# EasyEDA schematic SCH_sonnn_2025-09-09.json
TITLE: Sheet_1; REV: 2.0; Date: 2023-12-30; Sheet: 1/1; Drawn By: Belinay ve M. Ramazan; Company: Your Company
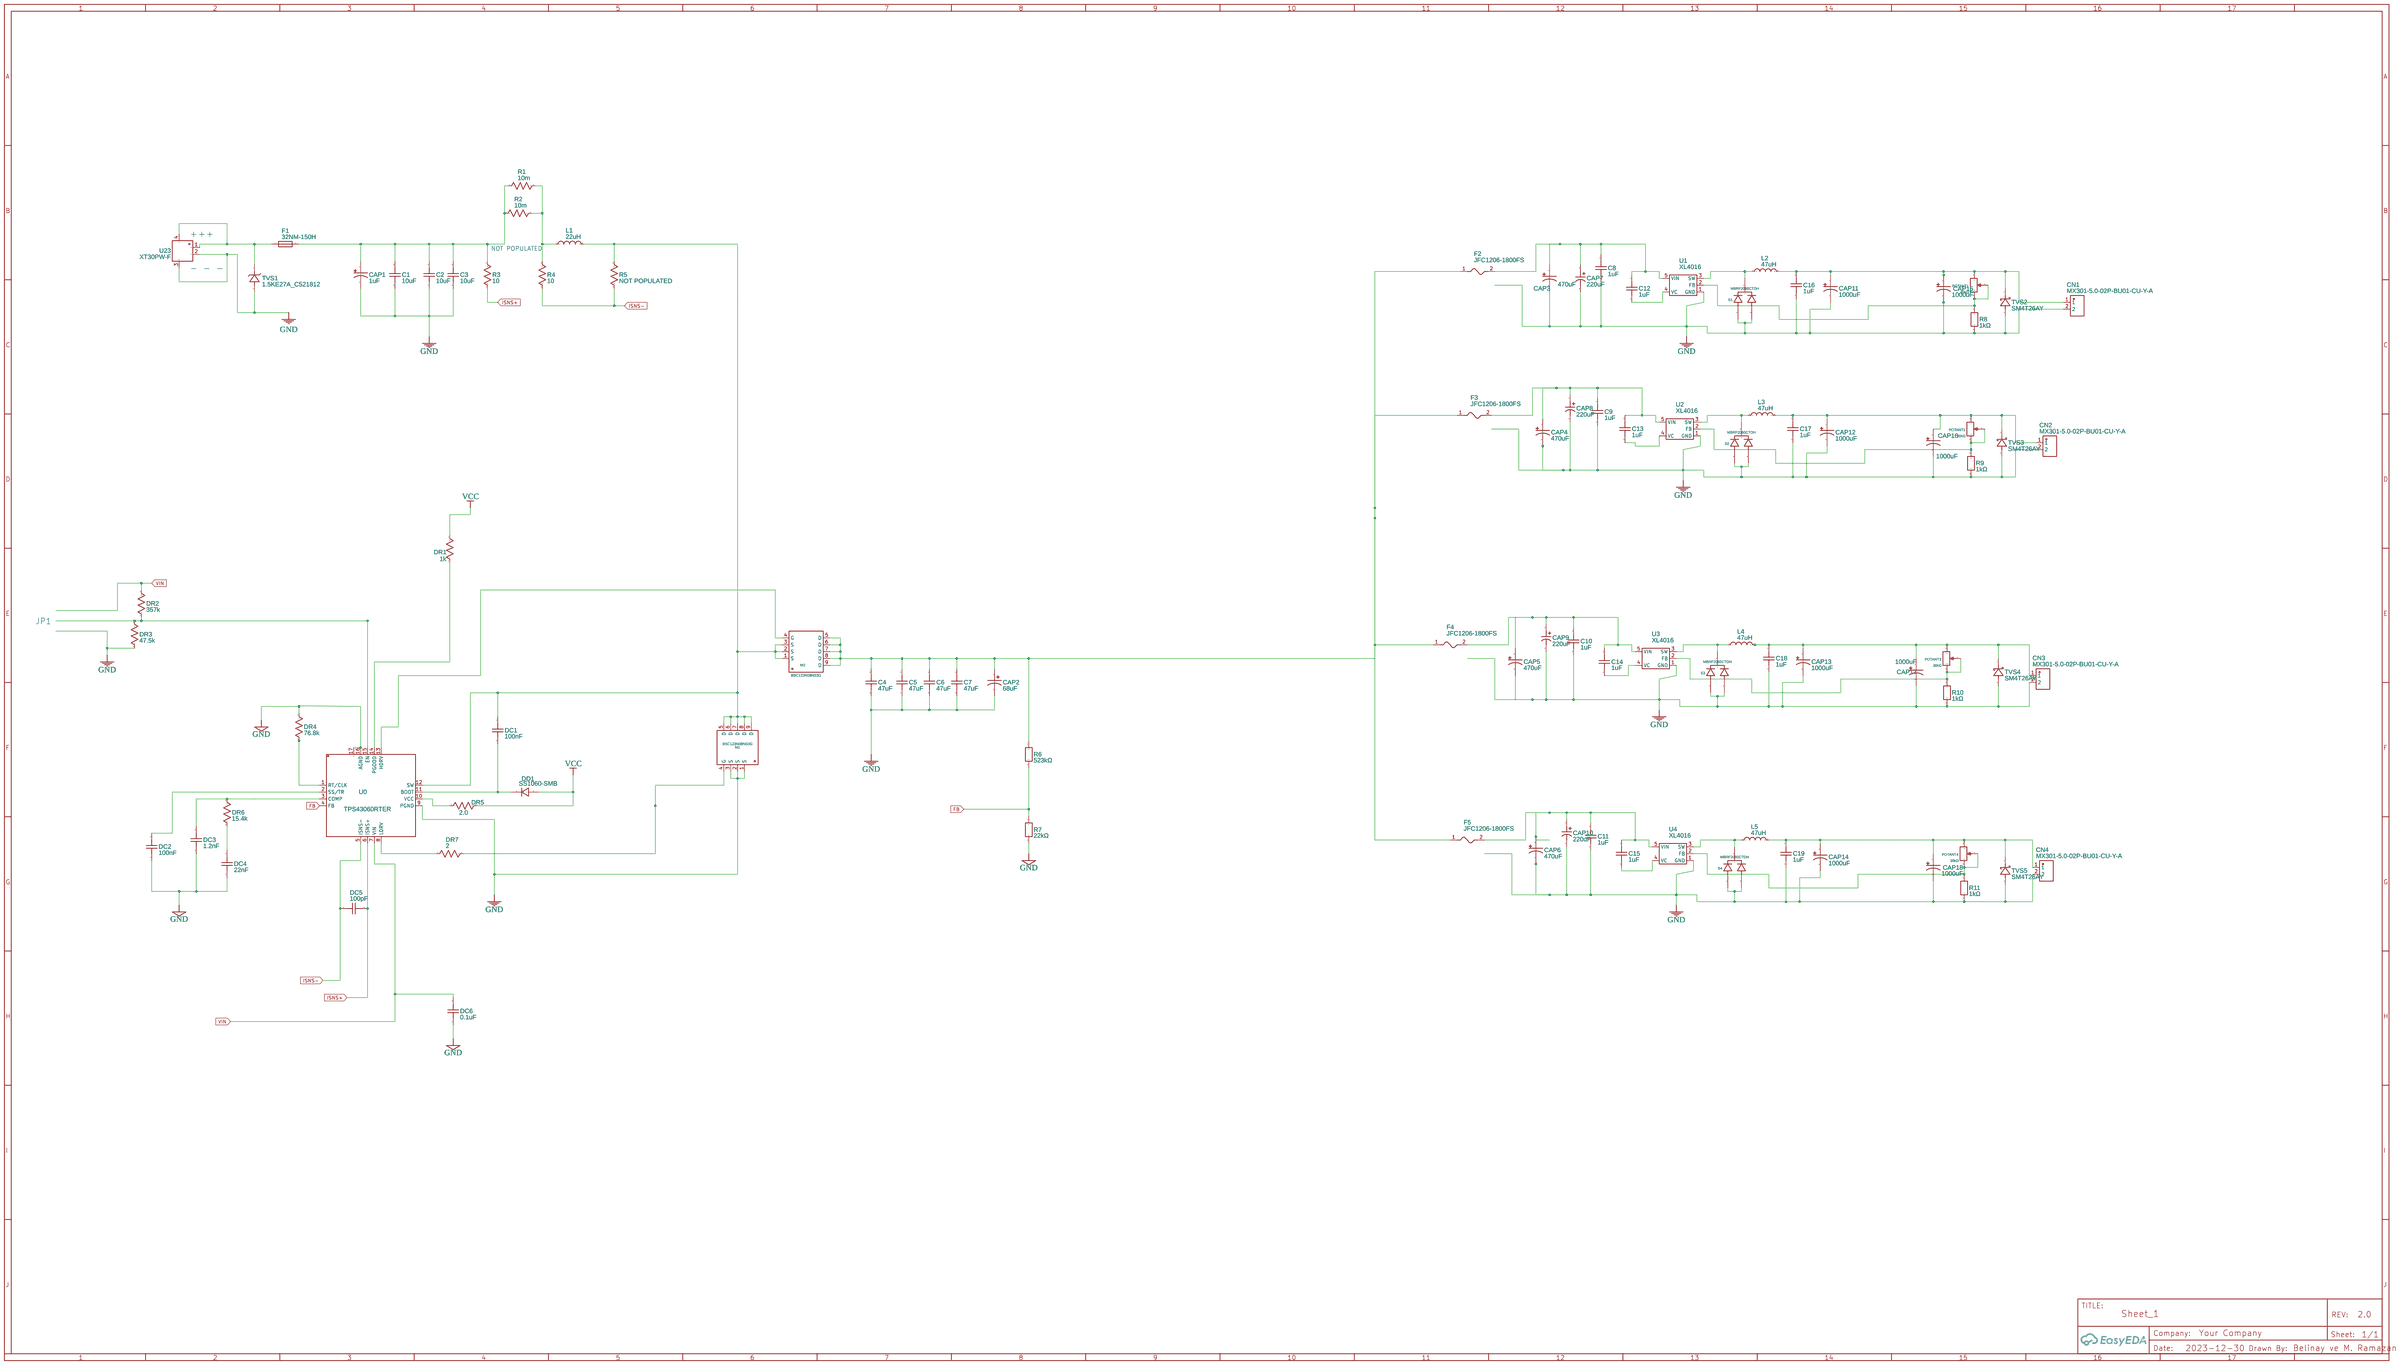
[diagram p0: schematic sheet]

## Parts
C1  10uF  [C1210]
C2  10uF  [C1210]
C3  10uF  [C1210]
C4  47uF  [C0603]
C5  47uF  [C0603]
C6  47uF  [C0603]
C7  47uF  [C0603]
C8  1uF  [CAP-TH_L5.5-W3.5-P5.00-D1.2]
C9  1uF  [CAP-TH_L5.5-W3.5-P5.00-D1.2]
C10  1uF  [CAP-TH_L5.5-W3.5-P5.00-D1.2]
C11  1uF  [CAP-TH_L5.5-W3.5-P5.00-D1.2]
C12  1uF  [C0402]
C13  1uF  [C0402]
C14  1uF  [C0402]
C15  1uF  [C0402]
C16  1uF  [CAP-TH_L5.5-W3.5-P5.00-D1.2]
C17  1uF  [CAP-TH_L5.5-W3.5-P5.00-D1.2]
C18  1uF  [CAP-TH_L5.5-W3.5-P5.00-D1.2]
C19  1uF  [CAP-TH_L5.5-W3.5-P5.00-D1.2]
CAP1  1uF  [CAP-SMD_BD4.0-L4.3-W4.3-FD-LS5.3]
CAP2  68uF  [CASE-A_3216]
CAP3  470uF  [CAP-TH_BD13.0-P5.00-D1.2-FD]
CAP4  470uF  [CAP-TH_BD13.0-P5.00-D1.2-FD]
CAP5  470uF  [CAP-TH_BD13.0-P5.00-D1.2-FD]
CAP6  470uF  [CAP-TH_BD13.0-P5.00-D1.2-FD]
CAP7  220uF  [CAP-SMD_BD10.0-L10.3-W10.3-LS11.0-FD]
CAP8  220uF  [CAP-SMD_BD10.0-L10.3-W10.3-LS11.0-FD]
CAP9  220uF  [CAP-SMD_BD10.0-L10.3-W10.3-LS11.0-FD]
CAP10  220uF  [CAP-SMD_BD10.0-L10.3-W10.3-LS11.0-FD]
CAP11  1000uF  [CAP-TH_BD12.5-P5.00-D0.6-FD]
CAP12  1000uF  [CAP-TH_BD12.5-P5.00-D0.6-FD]
CAP13  1000uF  [CAP-TH_BD12.5-P5.00-D0.6-FD]
CAP14  1000uF  [CAP-TH_BD12.5-P5.00-D0.6-FD]
CAP15  1000uF  [CAP-TH_BD12.5-P5.00-D0.6-FD]
CAP16  1000uF  [CAP-TH_BD12.5-P5.00-D0.6-FD]
CAP17  1000uF  [CAP-TH_BD12.5-P5.00-D0.6-FD]
CAP18  1000uF  [CAP-TH_BD12.5-P5.00-D0.6-FD]
CN1  MX301-5.0-02P-BU01-CU-Y-A  [CONN-TH_2P-P5.0-MX301-5.0-02P-BU01-CU-Y-A]
CN2  MX301-5.0-02P-BU01-CU-Y-A  [CONN-TH_2P-P5.0-MX301-5.0-02P-BU01-CU-Y-A]
CN3  MX301-5.0-02P-BU01-CU-Y-A  [CONN-TH_2P-P5.0-MX301-5.0-02P-BU01-CU-Y-A]
CN4  MX301-5.0-02P-BU01-CU-Y-A  [CONN-TH_2P-P5.0-MX301-5.0-02P-BU01-CU-Y-A]
DC1  100nF  [CAP-TH_L6.5-W3.0-P5.00-D0.6]
DC2  100nF  [CAP-TH_L6.5-W3.0-P5.00-D0.6]
DC3  1.2nF  [CAP-TH_L7.2-W2.5-P5.00-D0.5]
DC4  22nF  [CAP-TH_L11.5-W2.5-P5.00-D1.0]
DC5  100pF  [CAP-TH_L6.5-W3.0-P5.00-D0.6]
DC6  0.1uF  [C0603]
DD1  SS1060-SMB  [SMB_L4.4-W3.6-LS5.3-RD]
DR1  1k  [R_AXIAL-0.3]
DR2  357k  [R_AXIAL-0.3]
DR3  47.5k  [R_AXIAL-0.3]
DR4  76.8k  [R_AXIAL-0.3]
DR5  2.0  [R_AXIAL-0.3]
DR6  15.4k  [R_AXIAL-0.3]
DR7  2  [R_AXIAL-0.3]
F1  32NM-150H  [FUSE-TH_BD4.0-L11.0-P15.00-D0.6]
F2  JFC1206-1800FS  [F1206]
F3  JFC1206-1800FS  [F1206]
F4  JFC1206-1800FS  [F1206]
F5  JFC1206-1800FS  [F1206]
L1  22uH  [IND-TH_L23.0-W12.0-P9.00-D1.3]
L2  47uH  [IND-TH_L17.8-W17.8-P13.00-D0.6]
L3  47uH  [IND-TH_L17.8-W17.8-P13.00-D0.6]
L4  47uH  [IND-TH_L17.8-W17.8-P13.00-D0.6]
L5  47uH  [IND-TH_L17.8-W17.8-P13.00-D0.6]
M1  BSC123N08NS3G  [PG-TDSON-8_L5.0-W6.0-P1.27-LS6.2-BL-EP]
M2  BSC123N08NS3G  [PG-TDSON-8_L5.0-W6.0-P1.27-LS6.2-BL-EP]
POTANT1  30kΩ  [RES-ADJ-TH_3362P]
POTANT2  30kΩ  [RES-ADJ-TH_3362P]
POTANT3  30kΩ  [RES-ADJ-TH_3362P]
POTANT4  30kΩ  [RES-ADJ-TH_3362P]
R1  10m  [R_AXIAL-0.3]
R2  10m  [R_AXIAL-0.3]
R3  10  [R_AXIAL-0.3]
R4  10  [R_AXIAL-0.3]
R5  NOT POPULATED  [R_AXIAL-0.3]
R6  523kΩ  [RES-TH_BD2.4-L6.3-P10.30-D0.6]
R7  22kΩ  [RES-TH_BD5.0-L15.5-P19.50-D0.8]
R8  1kΩ  [RES-TH_BD2.4-L6.3-P10.30-D0.6]
R9  1kΩ  [RES-TH_BD2.4-L6.3-P10.30-D0.6]
R10  1kΩ  [RES-TH_BD2.4-L6.3-P10.30-D0.6]
R11  1kΩ  [RES-TH_BD2.4-L6.3-P10.30-D0.6]
S1  MBRF2060CTDH  [ITO-220AB-3_L10.2-W4.5-P2.60-L]
S2  MBRF2060CTDH  [ITO-220AB-3_L10.2-W4.5-P2.60-L]
S3  MBRF2060CTDH  [ITO-220AB-3_L10.2-W4.5-P2.60-L]
S4  MBRF2060CTDH  [ITO-220AB-3_L10.2-W4.5-P2.60-L]
TVS1  1.5KE27A_C521812  [DO-201_BD5.3-L9.5-P13.50-D1.4-RD]
TVS2  SM4T26AY  [SMA_L4.3-W2.6-LS5.1-RD]
TVS3  SM4T26AY  [SMA_L4.3-W2.6-LS5.1-RD]
TVS4  SM4T26AY  [SMA_L4.3-W2.6-LS5.1-RD]
TVS5  SM4T26AY  [SMA_L4.3-W2.6-LS5.1-RD]
U0  TPS43060RTER  [WQFN-16_L3.0-W3.0-P0.50-TL-EP]
U1  XL4016  [TO220-5L_L10.16-W4.5-P1.71-L]
U2  XL4016  [TO220-5L_L10.16-W4.5-P1.71-L]
U3  XL4016  [TO220-5L_L10.16-W4.5-P1.71-L]
U4  XL4016  [TO220-5L_L10.16-W4.5-P1.71-L]
U23  XT30PW-F  [CONN-TH_XT30PW-F-1]

## Library data of the parts
C1-C3 = CNC6P1X7R1H106K250AE: Contributor: lcsc; Supplier: LCSC; Supplier Part: C2175823; Manufacturer: TDK; JLCPCB Part Class: Extended Part
C4-C7 DC6 = C_0603_US: Contributor: LCEDA_Lib
C8-C11 C16-C19 = FK26X7R1H105KRE06: Contributor: LCSC; Supplier: LCSC; Supplier Part: C2839237; Manufacturer: TDK; JLCPCB Part Class: Extended Part
C12-C15 = C1005X6S1A105K050BC: Contributor: lcsc; Supplier: LCSC; Supplier Part: C2182694; Manufacturer: TDK
CAP1 = RVT2A1R0M0405: Supplier: LCSC; Manufacturer: HONOR(荣誉); Manufacturer Part: HT2A1R0M0405; Supplier Part: C87863; JLCPCB Part Class: Extended Part
CAP2 = C_Tan_SMD_A_US: Contributor: LCEDA_Lib
CAP3-CAP6 = RC063M471LO13*20TH-2A1E: Contributor: LCSC; Supplier: LCSC; Supplier Part: C357635; Manufacturer: BERYL(绿宝石); JLCPCB Part Class: Extended Part
CAP7-CAP10 = 189RV0038: Supplier: LCSC; Supplier Part: C7471900; Manufacturer: KNSCHA(科尼盛); JLCPCB Part Class: Extended Part; Contributor: lcsc
CAP11-CAP14 = PKCL21H102MF: Contributor: LCSC; Supplier: LCSC; Supplier Part: C269844; Manufacturer: Ymin(永铭); Manufacturer Part: PKCL2001H102MF; JLCPCB Part Class: Extended Part
CAP15-CAP18 = LKML3001J102MF: Contributor: LCSC; Supplier: LCSC; Supplier Part: C442961; Manufacturer: Ymin(永铭); JLCPCB Part Class: Extended Part
CN1-CN4 = MX301-5.0-02P-BU01-CU-Y-A: Supplier: LCSC; Supplier Part: C5188422; Manufacturer: MAX(迈旭); Manufacturer Part: MX301-5.0-02P-BU01-Cu-Y-A; Contributor: lcsc
DC1 DC2 = DCS104M26Y5UH6FJ5A0: Supplier: LCSC; Supplier Part: C2896064; Manufacturer: SHM(南方宏明); JLCPCB Part Class: Extended Part; Contributor: lcsc
DC3 = PE122J2A0501: Contributor: LCSC; Supplier: LCSC; Supplier Part: C393113; Manufacturer: KYET(科雅); JLCPCB Part Class: Extended Part
DC4 = DCM223M39Y5VL6FJ5A0: Contributor: LCSC; Supplier: LCSC; Supplier Part: C2896101; Manufacturer: SHM(南方宏明); JLCPCB Part Class: Extended Part
DC5 = DCC101J26COHF6FJ5A0: Contributor: lcsc; Supplier: LCSC; Supplier Part: C2896122; Manufacturer: SHM(南方宏明)
DD1 = SS1060-SMB: Contributor: lcsc; Supplier: LCSC; Supplier Part: C2891312; Manufacturer: GOODWORK(固得沃克)
DR1-DR6 R1-R5 = R_AXIAL-0.3_US: Contributor: LCEDA_Lib
DR7 = R_0603_US: Contributor: LCEDA_Lib
F1 = 32NM-150H: Contributor: LCSC; Supplier: LCSC; Supplier Part: C377319; Manufacturer: HOLLY(好利来); JLCPCB Part Class: Extended Part
F2-F5 = JFC1206-1800FS: Contributor: LCSC; Supplier: LCSC; Manufacturer: JDTfuse(集电通); Supplier Part: C136353; JLCPCB Part Class: Extended Part
L1 = PDMTAT068125-220MLU: Contributor: lcsc; Supplier: LCSC; Supplier Part: C3011539; Manufacturer: PROD(谱罗德); JLCPCB Part Class: Extended Part
L2-L5 = PDPMAA1712-470MP: Contributor: lcsc; Supplier: LCSC; Supplier Part: C5119635; Manufacturer: PROD(谱罗德); JLCPCB Part Class: Extended Part
M1 M2 = BSC123N08NS3G: Contributor: LCSC; Supplier: LCSC; Supplier Part: C412732; Manufacturer: Infineon(英飞凌); JLCPCB Part Class: Extended Part
POTANT1-POTANT4 = 3362P-1-103LF: Resistance(Ohms): 10K; Supplier: LCSC; Manufacturer: BOURNS; Supplier Part: C58159
R6 = MFR-25FBF52-523K: Contributor: lcsc; Supplier: LCSC; Supplier Part: C1367093; Manufacturer: YAGEO(国巨); JLCPCB Part Class: Extended Part
R7 = RN 3WS 22K F T/B A1: Contributor: LCSC; Supplier: LCSC; Supplier Part: C433559; Manufacturer: Tyohm(幸亚电阻); JLCPCB Part Class: Extended Part
R8-R11 = MF0207FTE52-1K: Contributor: lcsc; Supplier: LCSC; Supplier Part: C513706; Manufacturer: YAGEO(国巨); JLCPCB Part Class: Extended Part
S1-S4 = MBRF2060CTDH: Contributor: lcsc; Supplier: LCSC; Supplier Part: C2840785; Manufacturer: 迪一
TVS1 = 1.5KE27A_C521812: Contributor: LCSC; Supplier: LCSC; Supplier Part: C521812; Manufacturer: Brightking(君耀电子); Manufacturer Part: 1.5KE27A/B; JLCPCB Part Class: Extended Part
TVS2-TVS5 = SM4T26AY: Contributor: LCSC; Supplier: LCSC; Supplier Part: C1974615; Manufacturer: ST(意法半导体); JLCPCB Part Class: Extended Part
U0 = TPS43060RTER: Contributor: LCSC; Supplier: LCSC; Supplier Part: C76516; Manufacturer: TI(德州仪器); JLCPCB Part Class: Extended Part
U1-U4 = XL4016: catid: 20; link: https://lcsc.com/product-detail/DC-DC-Converters_XL4016E1_C55881.html; Contributor: andyfierman; Manufacturer Part: XL4016E1; Supplier: LCSC; Supplier Part: C55881; Manufacturer: XLSEMI
U23 = XT30PW-F: Contributor: LCSC; Supplier: LCSC; Supplier Part: C2913282; Manufacturer: null; JLCPCB Part Class: Extended Part

## Nets
GND: C1.1 C2.1 C3.1 C4.1 C5.1 C6.1 C7.1 C8.2 C9.2 C10.2 C11.2 C16.2 C17.1 C18.2 C19.2 CAP1.2 CAP2.2 CAP3.2 CAP4.2 CAP5.2 CAP6.2 CAP7.2 CAP8.2 CAP9.2 CAP10.2 CAP11.2 CAP12.2 CAP13.2 CAP14.2 CAP15.2 CAP16.2 CAP17.2 CAP18.2 CN1.2 CN2.2 CN3.2 CN4.2 DC2.1 DC3.1 DC4.1 DC6.1 DR3.1 DR4.2 M1.1(S) M1.2(S) M1.3(S) R7.2 R8.2 R9.2 R10.2 R11.2 S1.1 S1.3 S2.1 S2.3 S3.1 S3.3 S4.1 S4.3 TVS1.2(A) TVS2.2 TVS3.2 TVS4.2 TVS5.2 U0.9(PGND) U0.16(AGND) U0.17(PAD) U1.1(GND) U2.1(GND) U3.1(GND) U4.1(GND) U23.2 U23.3
VCC: DD1.2(A) DR1.2 DR5.2
VIN: DC6.2 DR2.2 U0.7(VIN)
FB: R6.1 R7.1 U0.4(FB)
ISNS+: DC5.2 R3.1 U0.6(ISNS+)
ISNS-: DC5.1 R4.1 R5.1 U0.5(ISNS-)
Net-(C1-2): C1.2 C2.2 C3.2 CAP1.1 F1.2 R1.1 R2.1 R3.2
Net-(C4-2): C4.2 C5.2 C6.2 C7.2 CAP2.1 F2.1 F3.1 F4.1 F5.1 M2.5(D) M2.6(D) M2.7(D) M2.8(D) M2.9(D) R6.2
Net-(C8-1): C8.1 C12.2 CAP3.1 CAP7.1 F2.2 U1.5(VIN)
Net-(C9-1): C9.1 C13.2 CAP4.1 CAP8.1 F3.2 U2.5(VIN)
Net-(C10-1): C10.1 C14.2 CAP5.1 CAP9.1 F4.2 U3.5(VIN)
Net-(C11-1): C11.1 C15.1 CAP6.1 CAP10.1 F5.2 U4.5(VIN)
Net-(C12-1): C12.1 U1.4(VC)
Net-(C13-1): C13.1 U2.4(VC)
Net-(C14-1): C14.1 U3.4(VC)
Net-(C15-2): C15.2 U4.4(VC)
Net-(C16-1): C16.1 CAP11.1 CAP15.1 CN1.1 L2.2 POTANT1.1 TVS2.1
Net-(C17-2): C17.2 CAP12.1 CAP16.1 CN2.1 L3.2 POTANT2.1 TVS3.1
Net-(C18-1): C18.1 CAP13.1 CAP17.1 CN3.1 L4.2 POTANT3.1 TVS4.1
Net-(C19-1): C19.1 CAP14.1 CAP18.1 CN4.1 L5.2 POTANT4.1 TVS5.1
Net-(DC1-1): DC1.1 L1.2 M1.5(D) M1.6(D) M1.7(D) M1.8(D) M1.9(D) M2.1(S) M2.2(S) M2.3(S) R5.2 U0.12(SW)
Net-(DC1-2): DC1.2 DD1.1(C) U0.11(BOOT)
Net-(DC2-2): DC2.2 U0.2(SS/TR)
Net-(DC3-2): DC3.2 DR6.2 U0.3(COMP)
Net-(DC4-2): DC4.2 DR6.1
Net-(DR1-1): DR1.1 U0.14(PGOOD)
Net-(DR2-1): DR2.1 DR3.2 U0.15(EN)
Net-(DR4-1): DR4.1 U0.1(RT/CLK)
Net-(DR5-1): DR5.1 U0.10(VCC)
Net-(DR7-1): DR7.1 U0.8(LDRV)
Net-(DR7-2): DR7.2 M1.4(G)
Net-(F1-1): F1.1 TVS1.1(C) U23.1 U23.4
Net-(L1-1): L1.1 R1.2 R2.2 R4.2
Net-(L2-1): L2.1 S1.2 U1.3(SW)
Net-(L3-1): L3.1 S2.2 U2.3(SW)
Net-(L4-1): L4.1 S3.2 U3.3(SW)
Net-(L5-1): L5.1 S4.2 U4.3(SW)
Net-(M2-4): M2.4(G) U0.13(HDRV)
Net-(POTANT1-2): POTANT1.2 POTANT1.3 R8.1 U1.2(FB)
Net-(POTANT2-2): POTANT2.2 POTANT2.3 R9.1 U2.2(FB)
Net-(POTANT3-2): POTANT3.2 POTANT3.3 R10.1 U3.2(FB)
Net-(POTANT4-2): POTANT4.2 POTANT4.3 R11.1 U4.2(FB)

## Notes on the sheet
- +++
- NOT POPULATED
- - - -
- JP1
